# EAGLE design Communications Board - Bottom (EAGLE 6.6.0)

## Sheet 1 of 3
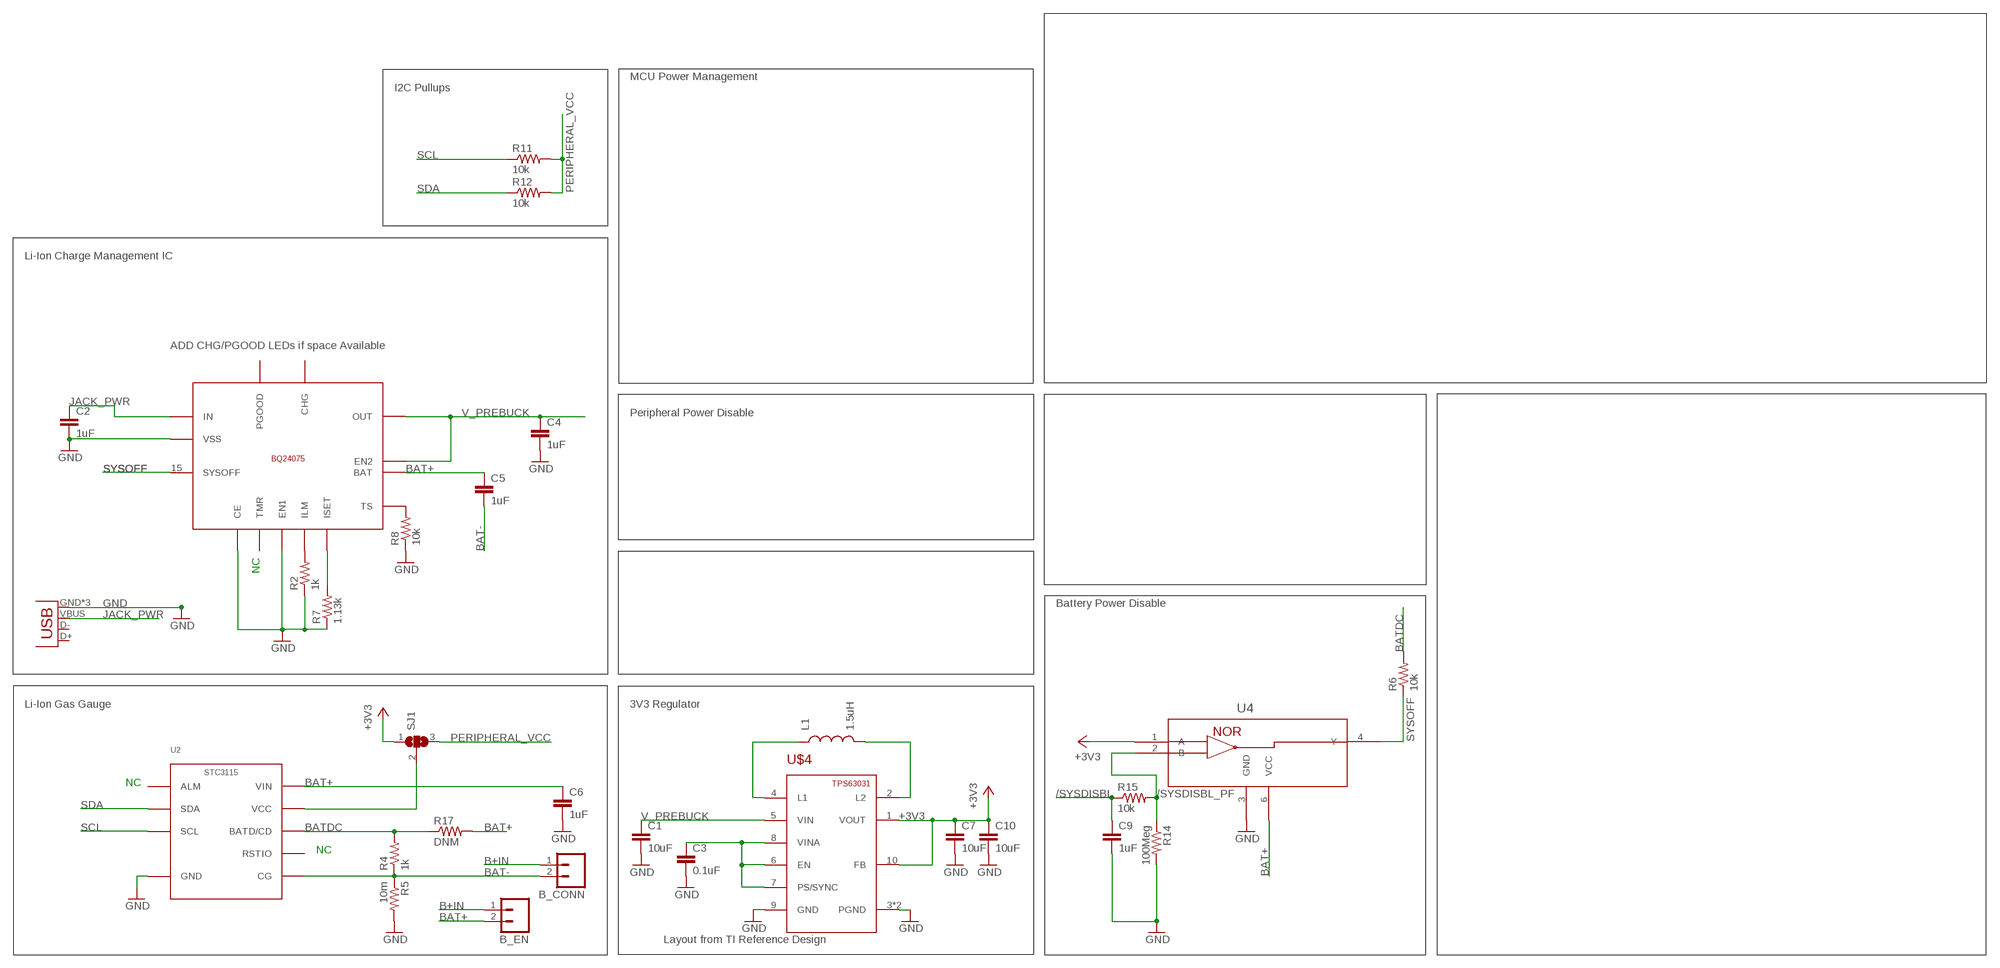
[diagram p0: schematic, sheet 1]

### Parts
B_CONN  M02PTH  [1X02]
B_EN  M02PTH  [1X02]
C1  10uF  CAP0402-CAP  [0402-CAP]
C2  1uF  CAP0603-CAP  [0603-CAP]
C3  0.1uF  CAP0402-CAP  [0402-CAP]
C4  1uF  CAP0603-CAP  [0603-CAP]
C5  1uF  CAP0603-CAP  [0603-CAP]
C6  1uF  CAP0603-CAP  [0603-CAP]
C7  10uF  CAP0402-CAP  [0402-CAP]
C9  1uF  CAP0603-CAP  [0603-CAP]
C10  10uF  CAP0603-CAP  [0603-CAP]
L1  1.5uH  INDUCTOR  [IND1212]
R2  1k  RESISTOR0603-RES  [0603-RES]
R4  1k  RESISTOR0603-RES  [0603-RES]
R5  10m  RESISTOR0603-RES  [0603-RES]
R6  10k  RESISTOR0603-RES  [0603-RES]
R7  1.13k  RESISTOR0603-RES  [0603-RES]
R8  10k  RESISTOR0603-RES  [0603-RES]
R11  10k  RESISTOR0603-RES  [0603-RES]
R12  10k  RESISTOR0603-RES  [0603-RES]
R14  100Meg  RESISTOR0603-RES  [0603-RES]
R15  10k  RESISTOR0603-RES  [0603-RES]
R17  DNM  RESISTOR0603-RES  [0603-RES]
SJ1  SJ2W  [SJ_2]
U2  STC3115  [DFN10-2X3]
U4  SN74AUP1G02_DSF_6  [DSF6]
U$2  BQ24075  [QFN16-3X3MM]
U$4  TPS63031  [SON-10]
X2  USB-MICROB  [USB-MICROB]

### Nets
+3V3: C7.1 C10.1 SJ1.1 U4.1(A) U$4.1(VOUT) U$4.10(FB) ; also sheet 3
/SYSDISBL: C9.1 R15.1 ; also sheet 3
/SYSDISBL_PF: R14.1 R15.2 U4.2(B)
B+IN: B_CONN.1 B_EN.1
BAT+: B_EN.2 C5.1 C6.1 R17.2 U2.P10(VIN) U4.6(VCC) U$2.2(BAT) U$2.3(BAT)
BAT-: B_CONN.2 C5.2 R4.1 R5.1 U2.P6(CG)
BATDC: R4.2 R6.2 R17.1 U2.P8(BATD/CD)
GND: C1.2 C2.2 C3.2 C4.2 C6.2 C7.2 C9.2 C10.2 R2.1 R5.2 R7.1 R8.1 R14.2 U2.P5(GND) U4.3(GND) U$2.4(CE) U$2.6(EN1) U$2.8(VSS) U$2.EXT(VSS) U$4.3(PGND) U$4.9(GND) U$4.PAD(PGND) X2.GND X2.MT1(GND) X2.MT2(GND) ; also sheet 3
JACK_PWR: C2.1 U$2.13(IN) X2.VBUS
N$5: L1.P$1 U$4.4(L1)
N$8: L1.P$2 U$4.2(L2)
N$10: C3.1 U$4.6(EN) U$4.7(PS/SYNC) U$4.8(VINA)
N$20: R8.2 U$2.1(TS)
N$23: R2.2 U$2.12(ILM)
N$24: R7.2 U$2.16(ISET)
N$26: SJ1.2 U2.P9(VCC)
PERIPHERAL_VCC: R11.2 R12.2 SJ1.3 ; also sheet 3
SCL: R11.1 U2.P3(SCL) ; also sheet 3
SDA: R12.1 U2.P2(SDA) ; also sheet 3
SYSOFF: R6.1 U4.4(Y) U$2.15(SYSOFF)
V_PREBUCK: C1.1 C4.1 U$2.5(EN2) U$2.10(OUT) U$2.11(OUT) U$4.5(VIN) ; also sheet 3
Unconnected: U2.P1(ALM) U2.P7(RSTIO) U$2.7(PGOOD) U$2.9(CHG) U$2.14(TMR) X2.D+ X2.D-

### Notes on the sheet
- MCU Power Management
- I2C Pullups
- Li-Ion Charge Management IC
- ADD CHG/PGOOD LEDs if space Available
- Peripheral Power Disable
- NC
- Battery Power Disable
- Li-Ion Gas Gauge | 3V3 Regulator
- NC
- NC
- Layout from TI Reference Design

## Sheet 2 of 3
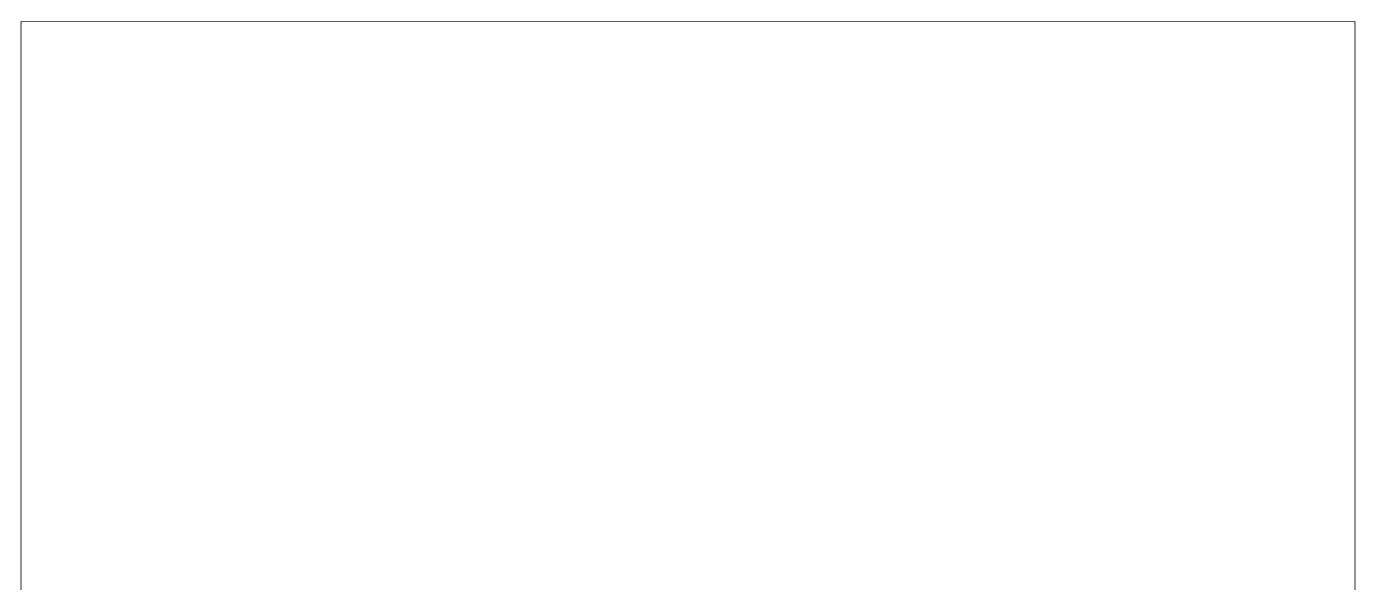
[diagram p1: schematic, sheet 2]

## Sheet 3 of 3
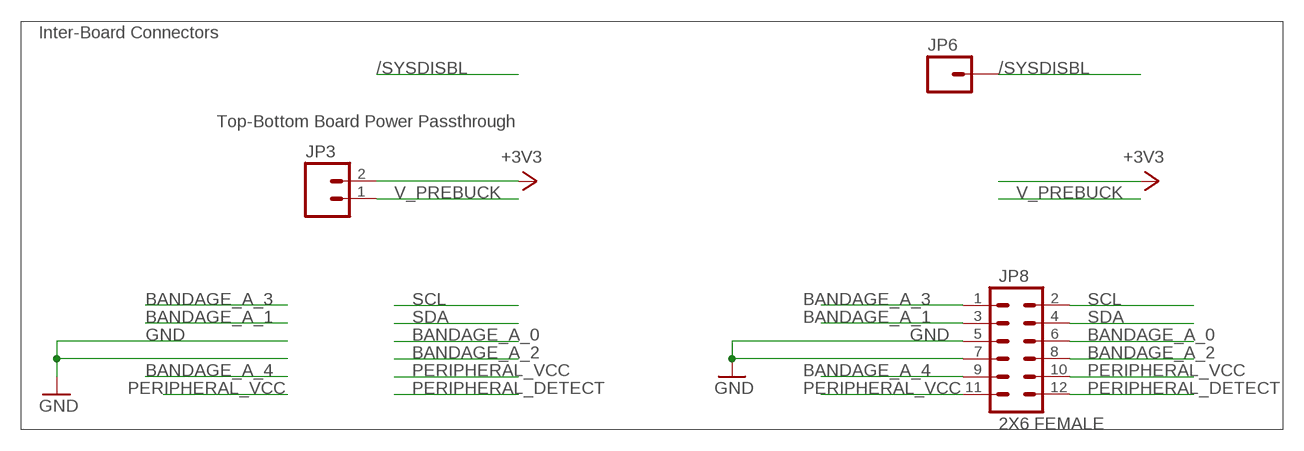
[diagram p2: schematic, sheet 3]

### Parts
JP3  M021X02_NO_SILK  [1X02_NO_SILK]
JP6  M01PTH  [1X01]
JP8  2X6 FEMALE  M06X2PTH_FEMALE  [2X6]

### Nets
+3V3: JP3.2 ; also sheet 1
/SYSDISBL: JP6.1 ; also sheet 1
BANDAGE_A_0: JP8.6
BANDAGE_A_1: JP8.3
BANDAGE_A_2: JP8.8
BANDAGE_A_3: JP8.1
BANDAGE_A_4: JP8.9
GND: JP8.5 JP8.7 ; also sheet 1
PERIPHERAL_DETECT: JP8.12
PERIPHERAL_VCC: JP8.10 JP8.11 ; also sheet 1
SCL: JP8.2 ; also sheet 1
SDA: JP8.4 ; also sheet 1
V_PREBUCK: JP3.1 ; also sheet 1

### Notes on the sheet
- Inter-Board Connectors
- Top-Bottom Board Power Passthrough

## Library data of the parts
B_CONN B_EN JP3 = SparkFun-Connectors:M02: Standard 2-pin 0.1" header. Use with - straight break away headers ( PRT-00116) - right angle break away headers (PRT-00553) - swiss pins (PRT-00743) - machine pins (PRT-00117) - female headers (PRT-00115) Molex polarized connector foot print use with: PRT-08233 with associated crimp pins and housings. 2.54_SCREWTERM for use with PRT-10571. 3.5mm Screw Terminal footprints for PRT-08084 5mm Screw Terminal footprints for use with PRT-08432
C1 C3 C7 C9 C10 = SparkFun-Passives:CAP: Capacitor Standard 0603 ceramic capacitor, and 0.1" leaded capacitor.
C2 C4-C6 = SparkFun:CAP: Capacitor Standard 0603 ceramic capacitor, and 0.1" leaded capacitor.
JP6 = SparkFun-Connectors:M01: Header 1 Standard 1-pin 0.1" header. Use with straight break away headers (SKU : PRT-00116), right angle break away headers (PRT-00553), swiss pins (PRT-00743), machine pins (PRT-00117), and female headers (PRT-00115).
JP8 = SparkFun-Connectors:M06X2; PROD_ID: CONN-12423
L1 = Capstone Library:INDUCTOR: Inductors Basic Inductor/Choke - 0603 and 1206. Footprints are not proven and vary greatly between part numbers. INDUCTOR POWER 3.3UH 4.0A SMD 0.197" L x 0.197" W x 0.177" H (5.00mm x 5.00mm x 4.50mm)
R2 R4-R8 R11 R12 R14 R15 R17 = SparkFun-Passives:RESISTOR: Resistor Basic schematic elements and footprints for 0603, 1206, and PTH resistors.
SJ1 = jumper:SJ2W: SMD solder JUMPER
U2 = Michael Blouin Library:STC3115: STC3115 Li-Ion Gas gauge IC with alarm output for handheld applications
U4 = Capstone Library:SN74AUP1G02_DSF_6; DATASHEETURL: http://www.ti.com/lit/gpn/SN74AUP1G02; DESCRIPTION: Low-Power Single 2-Input Positive-NOR Gate; FAMILY_NAME: LL NOR GATE; GENERIC_PART_NUMBER: SN74AUP1G02; INDUSTRY_STD_PKG_TYPE: SON; MANUFACTURER: Texas Instruments; MANUFACTURER_PART_NUMBER: sn74aup1g02_dsf_6; PACKAGE_DESIGNATOR: DSF; PIN_COUNT: 6; VENDOR: Texas Instruments
U$2 = CM Module Library:BQ24075
U$4 = Capstone Library:TPS63031
X2 = Capstone Library:USB: USB Connectors USB-B-PTH is fully proven SKU : PRT-00139 USB-miniB is fully proven SKU : PRT-00587 USB-A-PCB is untested. USB-A-H is throughly reviewed, but untested. Spark Fun Electronics SKU : PRT-00437 USB-B-SMT is throughly reviewed, but untested. Needs silkscreen touching up. USB-A-S has not been used/tested USB-MB-H has not been used/tested

## Board
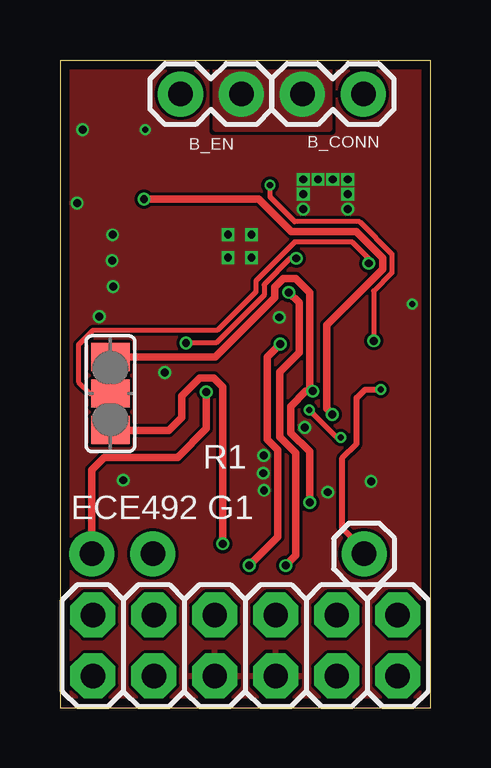
[diagram p3: board, top side]
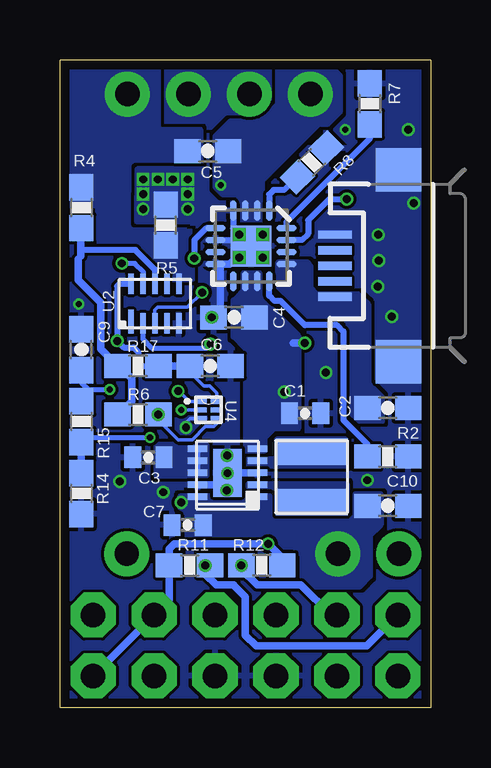
[diagram p4: board, bottom side, seen from below]

Size 15.45 x 27 mm. Coordinates in mm from the lower left corner, seen from the top.
Outline: 0,0 15.45,0 15.45,27 0,27 0,0
Copper layers (1*2*15*16): Top 0.035559375mm / dielectric 0.17018125mm / Route2 0.01778125mm / dielectric 47mil / Route15 0.01778125mm / dielectric 0.17018125mm / Bottom 0.035559375mm
Design rules "OSH Park 4 Layer *": minimum track width 5mil, minimum drill 10mil, track to track 5mil, track to pad 6mil, pad to pad 6mil, via to via 6mil, smd to smd 0mil, copper to edge 15mil, drill to drill 8mil, minimum pad ring 6mil, minimum via ring 4mil, stop-mask expansion 4mil, vias tented up to drill 100mil, thermal gap 6mil

### Footprints (pad centres in the part's own frame; a part is rotated, then mirrored left to right if it is on the bottom)
1X02 = drill 1.016 pad 1.88: 1 0,0; 2 2.54,0
0402-CAP = smd 0.7 x 0.9: 1 -0.65,0; 2 0.65,0
0603-CAP = smd 1.1 x 1: 1 -0.85,0; 2 0.85,0
1X02_NO_SILK = drill 1.016 pad 1.88: 1 0,0; 2 2.54,0
1X01 = drill 1.016 pad 1.88: 1 0,0
2X6 = drill 1.016 pad 1.88 octagon: 1 0,0; 2 0,2.54; 3 2.54,0; 4 2.54,2.54; 5 5.08,0; 6 5.08,2.54; 7 7.62,0; 8 7.62,2.54; 9 10.16,0; 10 10.16,2.54; 11 12.7,0; 12 12.7,2.54
IND1212 = smd 1.1 x 3: P$1 -1.05,0; P$2 1.05,0
0603-RES = smd 1.1 x 1: 1 -0.85,0; 2 0.85,0
SJ_2 = smd 1.168 x 1.6: 1 -1.524,0; 2 0,0; 3 1.524,0
DFN10-2X3 = smd 0.23 x 1: P1 -1,-0.75 | smd 0.23 x 0.85: P2 -0.5,-0.825; P3 0,-0.825; P4 0.5,-0.825; P5 1,-0.825; P6 1,0.825; P7 0.5,0.825; P8 0,0.825; P9 -0.5,0.825; P10 -1,0.825
DSF6 = smd 0.508 x 0.198: 1 -0.335,0.35; 2 -0.335,0; 3 -0.335,-0.35; 4 0.335,-0.35; 5 0.335,0; 6 0.335,0.35
QFN16-3X3MM = smd 0.85 x 0.28: 1 -1.475,0.75; 2 -1.475,0.25; 3 -1.475,-0.25; 4 -1.475,-0.75; 9 1.475,-0.75; 10 1.475,-0.25; 11 1.475,0.25; 12 1.475,0.75 | smd 0.28 x 0.85: 5 -0.75,-1.475; 6 -0.25,-1.475; 7 0.25,-1.475; 8 0.75,-1.475; 13 0.75,1.475; 14 0.25,1.475; 15 -0.25,1.475; 16 -0.75,1.475 | smd 1.7 x 1.7: EXT 0,0
SON-10 = smd 0.28 x 0.8: 1 -1,-1.25; 2 -0.5,-1.25; 3 0,-1.25; 4 0.5,-1.25; 5 1,-1.25; 6 1,1.25; 7 0.5,1.25; 8 0,1.25; 9 -0.5,1.25; 10 -1,1.25 | smd 2 x 1.2: PAD 0,0
USB-MICROB = smd 0.35 x 1.4: D+ 0,2.65; D- -0.65,2.65; GND 1.3,2.65; ID 0.65,2.65; VBUS -1.3,2.65 | smd 1.8 x 1.9: MT1 -4,0; MT2 4,0

### Placement (x,y rotation side)
B_CONN  10.1,25.58 0 top
B_EN  7.56,25.58 180 top
C1  5.24,12.27 0 bottom
C2  1.79,12.49 0 bottom
C3  11.77,10.43 180 bottom
C4  8.2,16.27 180 bottom
C5  9.29,23.2 180 bottom
C6  9.19,14.24 0 bottom
C7  10.13,7.61 180 bottom
C9  14.56,14.92 90 bottom
C10  1.79,8.41 0 bottom
JP3  1.33,6.41 0 top
JP6  12.67,6.41 0 top
JP8  1.37,1.32 0 top
L1  4.97,9.62 270 bottom
R2  1.79,10.46 180 bottom
R4  14.56,20.84 270 bottom
R5  11.05,20.12 90 bottom
R6  12.2,12.22 180 bottom
R7  2.54,25.17 270 bottom
R8  4.96,22.73 225 bottom
R11  10.05,5.93 180 bottom
R12  7.04,5.93 0 bottom
R14  14.56,8.92 270 bottom
R15  14.56,11.92 270 bottom
R17  12.2,14.24 0 bottom
SJ1  2.1,13.09 270 top
U2  11.5,16.84 0 bottom
U4  9.26,12.41 0 bottom
U$2  7.49,19.24 270 bottom
U$4  8.47,9.79 90 bottom
X2  1.35,18.42 90 bottom

### Tracks (layer width: path | path; a pad name or v marks a point on that pad's centre or on a via)
+3V3  (via drill 0.33)
  Top 0.305: SJ1.1 5.58,14.61 5.59,14.61 6.47,14.61 8.95,17.09 8.95,17.54 9.3,17.89 9.82,17.89 10.41,17.3 10.41,13.31 v10.53,13.19 10.25,13.19 9.62,12.56 9.62,11.45 10.4,10.67 v10.4,8.55
  Bottom 0.152: U4.1 10.07,12.76 10.5,13.19 v10.53,13.19
  pour Bottom (no thermals): 10.41,8.82 6.73,8.82 6.73,7.94 6.56,7.77 3.36,7.77 3.13,8 3.13,8.9 2.09,8.9 2.09,7.62 2.54,7.17 2.54,5.47 2.97,5.04 5.12,5.04 5.34,5.26 5.34,6.35 5.68,6.69 6.37,6.69 6.76,7.08 8.81,7.08 9.37,6.52 9.88,6.52 10.12,6.76 10.12,8.04 10.44,8.36 10.43,8.36 10.43,8.8
/SYSDISBL  (via drill 0.25)
  Top 0.254: JP6.1 12.67,6.6 11.77,7.5 11.77,10.41 12.36,11 12.36,12.91 12.71,13.26 v13.37,13.26
  Bottom 0.2: 14.28,13.26 14.56,12.98 R15.1 | 14.28,13.26 v13.37,13.26 | 14.28,13.26 14.56,13.54 C9.1
/SYSDISBL_PF  (via drill 0.25)
  Top 0.2: v11.7,11.26 11.53,11.26 v10.39,12.4
  Bottom 0.152: 14.44,11.19 R15.2 | U4.2 v10.38,12.41
  Bottom 0.2: v10.38,12.41 v10.39,12.4 | 14.44,11.19 14.37,11.26 v11.7,11.26
  Bottom 0.305: R14.1 R15.2
B+IN
  pour Bottom (rank 3, no thermals): 11.2,26.7 6.52,26.7 6.52,24.16 11.2,24.16
  pour Top (no thermals): 11.2,26.7 6.52,26.7 6.52,24.16 11.2,24.16
BAT+  (via drill 0.25, 0.33)
  Top 0.2: v13.07,15.29 13.07,17.37 13.83,18.13 13.83,18.91 12.48,20.26 9.78,20.26 8.75,21.29 v8.75,21.78
  Bottom 0.152: C6.1 10.04,13.99 9.46,13.41 9.22,13.41 8.92,13.11 U4.6
  Bottom 0.254: U2.P10 12.97,17.66 13.07,17.57 v13.07,15.29 12.8,15.02 12.38,15.02 12.19,14.83 12.19,14.33 12.1,14.24 R17.2
  Bottom 0.305: R17.2 C6.1
  pour Bottom (no thermals): 6.18,26.77 4.26,26.77 3.81,26.32 3.81,24.86 4.31,24.36 4.7,24.36 7.06,22 7.06,20.28 7.87,20.28 7.87,21.22 8.07,21.42 8.65,21.42 8.94,21.71 8.94,23.8 8.34,24.4 7.08,24.4 6.34,25.14 6.34,26.61
BAT-
  pour Bottom (rank 2, no thermals): 9.93,19.82 11.56,19.83 11.57,17.86 9.93,17.87
  pour Bottom (rank 2, no thermals): 15.18,26.73 11.38,26.73 11.38,24.1 9.61,24.1 9.61,22.6 12.44,22.6 12.44,20.11 10.3,20.11 10.3,18.55 11.58,18.55 12.29,19.26 13.86,19.26 13.86,20.92 15.19,20.92
BATDC
  Bottom 0.254: R17.1 13.48,14.67 | U2.P8 11.5,18.27 12.3,19.07 14.58,19.07 14.58,19.13
  Bottom 0.305: R6.2 13,12.22 12.46,12.76 12.46,13.72 12.98,14.24 R17.1 | 13.48,14.67 13.75,14.94 13.75,16.88 14.7,17.83 14.7,18.69 14.58,18.81 14.58,19.07 14.58,19.97 R4.2
GND  (via drill 0.25, 0.33, 0.33 pad 0.25, 0.33 pad 0.3)
  Bottom 0.152: U4.3 10.03,12.06 10.2,11.89 v10.2,11.68
  Bottom 0.254: U$2.6 8.21,19.49 v7.98,19.72 | U$2.4 8.24,19.98 v7.98,19.72 | v7.98,19.72 v7.97,19.72 U$2.EXT
  Bottom 0.305: v7.98,18.76 8.1,18.76 8.37,18.49 U$2.8 8.78,18.3 8.78,16.54 C4.2 | U$4.3 U$4.PAD | U$4.9 8.73,9.29 v8.5,9.06
  other vias: 7,18.76 7,19.72 10.13,20.78 10.13,21.4 10.13,22.02 10.75,22.02 11.37,22.02 11.99,22.02 11.99,21.4 11.99,20.78 2.19,19.71 9.13,16.27 14.67,16.83 3.56,24.1 8.47,9.77 8.49,10.51 4.37,13.97 11.15,8.98 12.96,9.43 2.64,9.48 2.17,18.64 2.21,17.55 1.63,16.3 0.71,21.03 0.94,24.1
  pour Top (rank 5): 0,27.11 15.45,27.11 15.45,0 0,0
  pour Bottom (rank 5): 0,0 0,27.11 15.45,27.11 15.45,0
  pour Bottom (no thermals): 12.23,22.44 12.25,20.28 9.77,20.28 9.77,22.44
  pour Bottom (no thermals): 4.8,20.16 4.8,19.45 3.12,19.45 3.12,20.15 3.17,20.15
  pour Bottom (no thermals): 2.59,23.16 1.93,23.82 0.49,23.82 0.49,21.21 2.64,21.21 2.64,23.02
  pour Bottom (rank 2, no thermals): 2.35,15.43 0.37,15.43 0.37,13.38 2.45,13.38 2.45,15.39
JACK_PWR
  pour Bottom (no thermals): 6.35,18.57 5.15,18.57 5.02,18.39 5.02,17.53 4.76,17.25 3.06,17.24 2.61,16.82 2.61,13.51 2.04,12.94 2.04,11.94 2.96,11.94 3.41,12.39 3.41,16.05 3.66,16.3 5.09,16.3 6.35,17.56
N$5
  pour Bottom (rank 2, no thermals): 7.59,10.1 3.55,10.1 3.55,11.17 6.42,11.17 6.42,10.35 7.59,10.35
N$8
  pour Bottom (rank 2, no thermals): 7.58,9.33 3.51,9.33 3.51,8.08 6.4,8.08 6.4,8.92 6.56,9.21 7.6,9.21 7.59,9.32
N$10
  Bottom 0.23: U$4.6 U$4.7 U$4.8
  pour Bottom (no thermals): 11.4,10.92 9.37,10.92 9.37,9.69 11.4,9.69
N$20
  Bottom 0.254: R8.2 6.11,21.58 6.55,21.58 6.74,21.39 U$2.1
N$23
  Bottom 0.254: R2.2 2.64,10.98 3.64,11.98 3.64,15.68 3.9,15.94 5.25,15.94 6.26,16.95 6.52,16.95 6.74,17.17 U$2.12
N$24
  Bottom 0.254: R7.2 2.54,23.72 6.01,20.25 U$2.16
N$26  (via drill 0.33)
  Top 0.2: SJ1.2 1.26,13.09 0.77,13.58 0.77,15.12 1.37,15.72 6.55,15.72 8.16,17.33 8.16,17.79 9.78,19.41 12.17,19.41 12.87,18.71 v12.87,18.52
  Bottom 0.2: U2.P9 11.99,17.68 11.99,18.18 12.33,18.52 v12.87,18.52
PERIPHERAL_VCC  (via drill 0.33)
  Top 0.305: SJ1.3 2.12,11.55 4.53,11.55 5.07,12.09 5.07,13 5.82,13.75 6.4,13.75 6.78,13.37 v6.78,6.83
  Bottom 0.305: R12.2 6.19,6.24 v6.78,6.83 10.68,6.83 10.9,6.61 R11.2 10.9,4.49 JP8.10 JP8.11
SCL  (via drill 0.33)
  Top 0.305: v9.4,5.92 9.82,6.34 9.82,10.62 9.15,11.29 9.15,13.99 9.96,14.8 9.96,16.88 v9.53,17.31
  Bottom 0.152: v9.53,17.31 10.15,16.69 11.38,16.69 11.5,16.57 U2.P3
  Bottom 0.305: R11.1 v9.4,5.92 9.4,5.56 9.39,5.56 8.94,5.11 8.21,5.11 8.21,5.1 7.73,4.62 7.73,3.02 7.28,2.57 2.66,2.57 JP8.2
SDA  (via drill 0.33)
  Top 0.305: R12.1 9.08,7.12 9.08,10.73 8.64,11.17 8.64,14.61 v9.18,15.15
  Bottom 0.2: U2.P2 12,15.36 11.64,15 9.33,15 v9.18,15.15
  Bottom 0.305: R12.1 7.89,5.77 7.24,5.12 5.41,5.12 4.15,3.86 JP8.4
  other vias: 7.89,5.93
SYSOFF  (via drill 0.33)
  Top 0.305: R6.1 11.11,12.46 11.11,15.95 13.45,18.29 13.45,18.75 12.35,19.85 9.64,19.85 8.29,21.2 v3.5,21.2
  Bottom 0.152: R6.1 11.35,11.99 10.52,11.16 9.95,11.16 9.39,11.72 9.04,11.72 8.93,11.83 U4.4
  Bottom 0.254: U$2.15 5.37,19.49 5.11,19.75 5.11,20.32 4.23,21.2 v3.5,21.2
  Bottom 0.305: 11.58,12.22 R6.1
  other vias: 11.35,12.22
V_PREBUCK  (via drill 0.33)
  Top 0.2: v9.85,18.73 9.6,18.73 8.5,17.63 8.5,17.19 6.51,15.2 v5.25,15.2
  Top 0.305: v6.1,13.15 6.1,11.63 4.9,10.43 1.85,10.43 1.33,9.91 JP3.1
  Bottom 0.254: U$2.5 8.97,19.98 9.36,19.98 9.85,19.49 v9.85,18.73
  Bottom 0.305: v5.25,15.2 5.74,15.2
  pour Bottom (no thermals): 7.79,18.12 7.15,18.12 7.15,17.13 5.53,15.51 5.53,11.63 6.55,11.63 6.93,11.25 6.93,10.7 7.69,10.7 7.69,14.93 8.22,15.46 8.22,16.97 7.79,17.4

### Text on the board
tNames: R1 | ECE492 G1